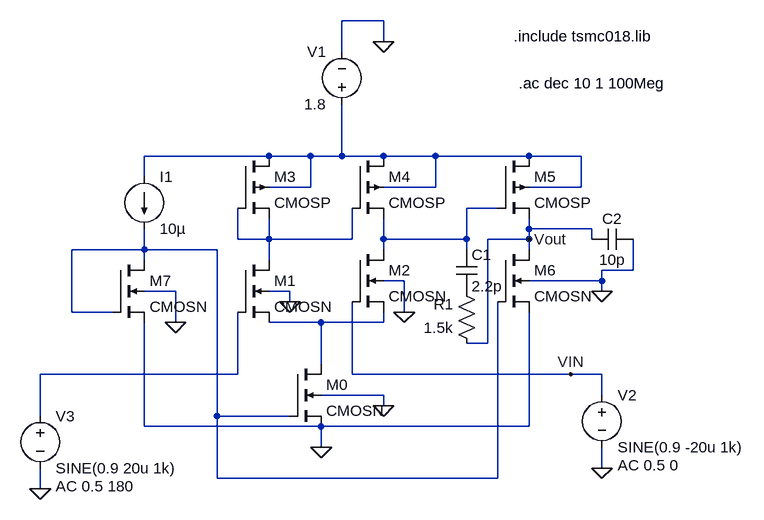
[diagram p0: schematic open-loop2-stage_ota.asc]
open-loop2-stage_ota.asc, the LTspice schematic file:
Version 4.1
SHEET 1 1344 680
WIRE 288 -336 224 -336
WIRE 288 -304 288 -336
WIRE 224 -288 224 -336
WIRE 112 -128 -80 -128
WIRE 176 -128 112 -128
WIRE 224 -128 224 -208
WIRE 224 -128 176 -128
WIRE 288 -128 224 -128
WIRE 368 -128 288 -128
WIRE 512 -128 368 -128
WIRE 592 -128 512 -128
WIRE 288 -112 288 -128
WIRE -80 -96 -80 -128
WIRE 176 -80 176 -128
WIRE 176 -80 112 -80
WIRE 368 -80 368 -128
WIRE 368 -80 288 -80
WIRE 592 -80 592 -128
WIRE 592 -80 512 -80
WIRE 464 -48 416 -48
WIRE 512 -16 512 -32
WIRE 608 -16 512 -16
WIRE 64 0 64 -48
WIRE 112 0 112 -32
WIRE 112 0 64 0
WIRE 240 0 240 -48
WIRE 240 0 112 0
WIRE 288 0 288 -32
WIRE 416 0 416 -48
WIRE 416 0 288 0
WIRE 512 0 512 -16
WIRE 512 0 448 0
WIRE 608 0 608 -16
WIRE -80 16 -80 -16
WIRE -80 16 -192 16
WIRE 32 16 -80 16
WIRE 288 16 288 0
WIRE 416 16 416 0
WIRE 512 16 512 0
WIRE -80 32 -80 16
WIRE 112 32 112 0
WIRE 672 48 672 0
WIRE 672 48 624 48
WIRE 320 64 288 64
WIRE 624 64 624 48
WIRE 624 64 512 64
WIRE -32 80 -80 80
WIRE 144 80 112 80
WIRE 624 80 624 64
WIRE 144 96 144 80
WIRE -192 112 -192 16
WIRE -128 112 -192 112
WIRE 320 112 320 64
WIRE -32 128 -32 80
WIRE 192 128 112 128
WIRE 288 128 288 112
WIRE 288 128 192 128
WIRE 448 160 448 0
WIRE 448 160 416 160
WIRE 192 192 192 128
WIRE 64 208 64 112
WIRE 64 208 -240 208
WIRE 240 208 240 96
WIRE 576 208 240 208
WIRE 624 208 576 208
WIRE 288 240 192 240
WIRE 624 240 624 208
WIRE 288 256 288 240
WIRE -240 272 -240 208
WIRE 32 272 32 16
WIRE 144 272 32 272
WIRE -80 288 -80 128
WIRE 192 288 -80 288
WIRE 512 288 512 112
WIRE 512 288 192 288
WIRE 192 320 192 288
WIRE 624 352 624 320
WIRE 32 368 32 272
WIRE 464 368 464 96
WIRE 464 368 32 368
WIRE -240 384 -240 352
FLAG 192 320 0
FLAG -32 128 0
FLAG 288 256 0
FLAG 320 112 0
FLAG 144 96 0
FLAG 624 80 0
FLAG 288 -304 0
FLAG 624 352 0
FLAG 512 0 Vout
FLAG 576 208 VIN
FLAG -240 384 0
SYMBOL nmos4 64 32 R0
SYMATTR InstName M1
SYMATTR Value CMOSN
SYMATTR Value2 l=0.180u w=5.434u
SYMBOL pmos4 64 -128 R0
SYMATTR InstName M3
SYMATTR Value CMOSP
SYMATTR Value2 l=0.180u w=12.5u
SYMBOL pmos4 240 -128 R0
SYMATTR InstName M4
SYMATTR Value CMOSP
SYMATTR Value2 l=0.18u w=12.5u
SYMBOL pmos4 464 -128 R0
SYMATTR InstName M5
SYMATTR Value CMOSP
SYMATTR Value2 l=0.18u w=56u
SYMBOL nmos4 240 16 R0
SYMATTR InstName M2
SYMATTR Value CMOSN
SYMATTR Value2 l=0.180u w=5.434u
SYMBOL nmos4 464 16 R0
SYMATTR InstName M6
SYMATTR Value CMOSN
SYMATTR Value2 l=0.18u w=19.566u
SYMBOL nmos4 -128 32 R0
SYMATTR InstName M7
SYMATTR Value CMOSN
SYMATTR Value2 l=0.18u w=0.39132u
SYMBOL nmos4 144 192 R0
SYMATTR InstName M0
SYMATTR Value CMOSN
SYMATTR Value2 l=0.180u w=10.86u
SYMBOL current -80 -96 R0
WINDOW 123 0 0 Left 0
WINDOW 39 0 0 Left 0
SYMATTR InstName I1
SYMATTR Value 10µ
SYMBOL voltage 224 -192 R180
WINDOW 0 24 96 Left 2
WINDOW 3 24 16 Left 2
WINDOW 123 0 0 Left 0
WINDOW 39 0 0 Left 0
SYMATTR InstName V1
SYMATTR Value 1.8
SYMBOL voltage 624 224 R0
WINDOW 123 24 124 Left 2
WINDOW 39 0 0 Left 0
SYMATTR Value2 AC 0.5 0
SYMATTR InstName V2
SYMATTR Value SINE(0.9 -20u 1k)
SYMBOL res 432 176 R180
WINDOW 0 36 76 Left 2
WINDOW 3 36 40 Left 2
SYMATTR InstName R1
SYMATTR Value 1.5k
SYMBOL cap 400 16 R0
SYMATTR InstName C1
SYMATTR Value 2.2p
SYMBOL cap 672 -16 R90
WINDOW 0 0 32 VBottom 2
WINDOW 3 32 32 VTop 2
SYMATTR InstName C2
SYMATTR Value 10p
SYMBOL voltage -240 256 R0
WINDOW 123 24 124 Left 2
WINDOW 39 0 0 Left 0
SYMATTR Value2 AC 0.5 180
SYMATTR InstName V3
SYMATTR Value SINE(0.9 20u 1k)
TEXT 488 -312 Left 2 !.include tsmc018.lib
TEXT 496 -240 Left 2 !.ac dec 10 1 100Meg

The netlist it stands for:
* open-loop2-stage_ota.asc
M1 N003 N006 N005 0 CMOSN l=0.180u w=5.434u
M3 N001 N003 N003 N001 CMOSP l=0.180u w=12.5u
M4 N001 N003 N002 N001 CMOSP l=0.18u w=12.5u
M5 N001 N002 Vout N001 CMOSP l=0.18u w=56u
M2 N002 VIN N005 0 CMOSN l=0.180u w=5.434u
M6 Vout N004 0 0 CMOSN l=0.18u w=19.566u
M7 N004 N004 0 0 CMOSN l=0.18u w=0.39132u
M0 N005 N004 0 0 CMOSN l=0.180u w=10.86u
I1 N001 N004 10µ
V1 N001 0 1.8
V2 VIN 0 SINE(0.9 -20u 1k) AC 0.5 0
R1 Vout P001 1.5k
C1 N002 P001 2.2p
C2 0 Vout 10p
V3 N006 0 SINE(0.9 20u 1k) AC 0.5 180
.model NMOS NMOS
.model PMOS PMOS
.lib standard.mos
.include tsmc018.lib
.ac dec 10 1 100Meg
.backanno
.end